# Altium project uC_Interface_PCB.PrjPcb
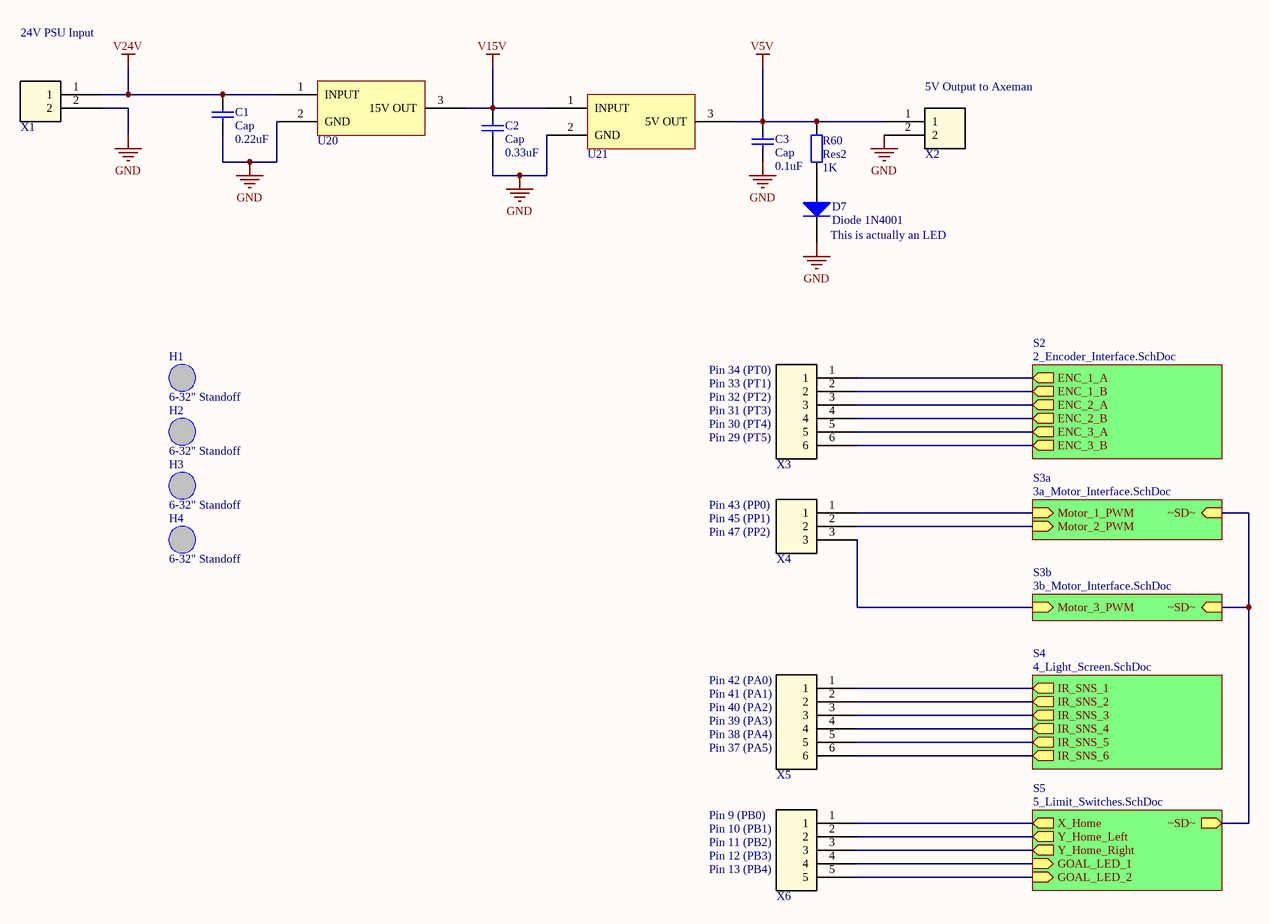
[diagram p0: 1_Top_Sheet.SchDoc]
6 sheets, 208 parts. Net scope: hierarchical (ports join the sheet entries above them; power ports are global).
Board file: uC_interface_pcb.PcbDoc
Sheets:
  1_Top_Sheet.SchDoc
    S2 = 2_Encoder_Interface.SchDoc
    S3a = 3a_Motor_Interface.SchDoc
    S3b = 3b_Motor_Interface.SchDoc
    S4 = 4_Light_Screen.SchDoc
    S5 = 5_Limit_Switches.SchDoc

## Sheet 1_Top_Sheet.SchDoc
size B

### Parts
C1  Cap  value 0.22uF  [RAD-0.3]
C2  Cap  value 0.33uF  [RAD-0.3]
C3  Cap  value 0.1uF  [RAD-0.3]
D7  Diode 1N4001  [DO-41]
H1  6-32" Standoff  [6-32" Standoff]
H2  6-32" Standoff  [6-32" Standoff]
H3  6-32" Standoff  [6-32" Standoff]
H4  6-32" Standoff  [6-32" Standoff]
R60  Res2  value 1K  [AXIAL-0.4]
U20  IC REG LINEAR 15V 1A TO220-3  [TO-220]  (value not drawn)
U21  IC REG LINEAR 5V 1.5A TO220-3  [TO-220]  (value not drawn)
X1  TERM BLOCK HDR 2POS VERT 7.62MM  [PCV 4-2]  (value not drawn)
X2  TERM BLOCK HDR 2POS VERT 3.5MM  [WR-TBL-3211 2]  (value not drawn)
X3  TERM BLOCK HDR 6POS VERT 3.5MM  [WR-TBL-3211 6]  (value not drawn)
X4  TERM BLOCK HDR 3POS VERT 3.5MM  [WR-TBL-3211 3]  (value not drawn)
X5  TERM BLOCK HDR 6POS VERT 3.5MM  [WR-TBL-3211 6]  (value not drawn)
X6  TERM BLOCK HDR 5POS VERT 3.5MM  [WR-TBL-3211 5]  (value not drawn)

### Sub-sheets
S2 = 2_Encoder_Interface.SchDoc: ENC_1_A (out), ENC_1_B (out), ENC_2_A (out), ENC_2_B (out), ENC_3_A (out), ENC_3_B (out)
S3a = 3a_Motor_Interface.SchDoc: Motor_1_PWM (in), Motor_2_PWM (in), ~SD~ (in)
S3b = 3b_Motor_Interface.SchDoc: Motor_3_PWM (in), ~SD~ (in)
S4 = 4_Light_Screen.SchDoc: IR_SNS_1 (out), IR_SNS_2 (out), IR_SNS_3 (out), IR_SNS_4 (out), IR_SNS_5 (out), IR_SNS_6 (out)
S5 = 5_Limit_Switches.SchDoc: X_Home (out), Y_Home_Left (out), Y_Home_Right (out), ~SD~ (out), GOAL_LED_1 (in), GOAL_LED_2 (in)

### Nets
GND: C1.1 C2.1 C3.1 D7.2(K) U20.2(GND) U21.2(GND) X1.2 X2.2
V5V: C3.2 R60.2 U21.3(5V_OUT) X2.1
V15V: C2.2 U20.3(15V_OUT) U21.1(INPUT)
V24V: C1.2 U20.1(INPUT) X1.1
ENC_1_A: X3.1 ; sheet S2/ENC_1_A
ENC_1_B: X3.2 ; sheet S2/ENC_1_B
ENC_2_A: X3.3 ; sheet S2/ENC_2_A
ENC_2_B: X3.4 ; sheet S2/ENC_2_B
ENC_3_A: X3.5 ; sheet S2/ENC_3_A
ENC_3_B: X3.6 ; sheet S2/ENC_3_B
GOAL_LED_1: X6.4 ; sheet S5/GOAL_LED_1
GOAL_LED_2: X6.5 ; sheet S5/GOAL_LED_2
IR_SNS_1: X5.1 ; sheet S4/IR_SNS_1
IR_SNS_2: X5.2 ; sheet S4/IR_SNS_2
IR_SNS_3: X5.3 ; sheet S4/IR_SNS_3
IR_SNS_4: X5.4 ; sheet S4/IR_SNS_4
IR_SNS_5: X5.5 ; sheet S4/IR_SNS_5
IR_SNS_6: X5.6 ; sheet S4/IR_SNS_6
Motor_1_PWM: X4.1 ; sheet S3a/Motor_1_PWM
Motor_2_PWM: X4.2 ; sheet S3a/Motor_2_PWM
Motor_3_PWM: X4.3 ; sheet S3b/Motor_3_PWM
X_Home: X6.1 ; sheet S5/X_Home
Y_Home_Left: X6.2 ; sheet S5/Y_Home_Left
Y_Home_Right: X6.3 ; sheet S5/Y_Home_Right
~SD~: sheet S3a/~SD~, sheet S3b/~SD~, sheet S5/~SD~
NetD7_1: D7.1(A) R60.1

### Notes on the sheet
- 24V PSU Input
- (near X2) 5V Output to Axeman
- (near D7) This is actually an LED
- (near X3) Pin 34 (PT0)
- (near X3) Pin 33 (PT1)
- (near X3) Pin 32 (PT2)
- (near X3) Pin 31 (PT3)
- (near X3) Pin 30 (PT4)
- (near X3) Pin 29 (PT5)
- (near X4) Pin 43 (PP0)
- (near X4) Pin 45 (PP1)
- (near X4) Pin 47 (PP2)
- (near X5) Pin 42 (PA0)
- (near X5) Pin 41 (PA1)
- (near X5) Pin 40 (PA2)
- (near X5) Pin 39 (PA3)
- (near X5) Pin 38 (PA4)
- (near X5) Pin 37 (PA5)
- (near X6) Pin 9 (PB0)
- (near X6) Pin 10 (PB1)
- (near X6) Pin 11 (PB2)
- (near X6) Pin 12 (PB3)
- (near X6) Pin 13 (PB4)
- ESE
- is the sole property of ESE. Any reproduction
- The Information Contained in this drawing
- Schematic P/N and Name
- Sheet Name
- 299 Doon Valley Drive
- Kitchener, ON N2G 4M4
- Canada
- Approved
- in part or in whole without the written
- permission of ESE is strictly prohibited.
- APPROVALS
- DATE
- Size
- Scale
- B
- NTS
- Bare PCB P/N
- Date
- Sheet
- Rev.
- Checked
- Engineer
- of

### Library data of the parts
C1-C3 = Cap: Capacitor; Published: 8-Jun-2000; LatestRevisionDate: 17-Jul-2002; LatestRevisionNote: Re-released for DXP Platform.; PackageReference: RAD-0.3; Publisher: Altium Limited; PackageDescription: Radial Cap, Thru-Hole; 2 Leads; 0.3 in Pin Spacing
D7 = Diode 1N4001: 1 Amp General Purpose Rectifier; Published: 8-Jun-2000; LatestRevisionDate: 17-Jul-2002; LatestRevisionNote: Re-released for DXP Platform.; DatasheetVersion: 1998; PackageVersion: Aug-1999; PackageReference: DO-41; Publisher: Altium Limited; PackageDescription: Diode, Axial; Body 5.2 x 2.7 mm (LxDia. max), Lead Dia. 0.86 mm (max); Code_JEDEC: DO-204-AL; ComponentLink1Description: Manufacturer Link; ComponentLink1URL: http://www.fairchildsemi.com/; ComponentLink2Description: Datasheet; ComponentLink2URL: http://www.fairchildsemi.com/ds/1N%2F1N4001.pdf
H1-H4 = 6-32" Standoff: Mounting hole for 6-32" Standoff
R60 = Res2: Resistor; Published: 8-Jun-2000; LatestRevisionDate: 17-Jul-2002; LatestRevisionNote: Re-released for DXP Platform.; PackageReference: AXIAL-0.4; Publisher: Altium Limited; PackageDescription: Axial Device, Thru-Hole; 2 Leads; 0.4 in Pin Spacing
U20 = IC REG LINEAR 15V 1A TO220-3: Manufacturer_Part_Number: LM340T-15/NOPB; Manufacturer: Texas Instruments; Digi-Key_Part_Number: LM340T-15/NOPB-ND
U21 = IC REG LINEAR 5V 1.5A TO220-3: Manufacturer_Part_Number: UA7805CKCS; Manufacturer: Texas Instruments; Digi-Key_Part_Number: 296-13996-5-ND
X1 = TERM BLOCK HDR 2POS VERT 7.62MM: Manufacturer_Part_Number: 1804687; Manufacturer: Phoenix Contact; DigiKey_Part_Number: 277-1469-ND
X2 = TERM BLOCK HDR 2POS VERT 3.5MM: Manufacturer_Part_Number: 691321100002; Manufacturer: Wurth Electronics Inc; DigiKey_Part_Number: 732-2763-ND
X3 X5 = TERM BLOCK HDR 6POS VERT 3.5MM: Manufacturer_Part_Number: 691321100006; Manufacturer: Wurth Electronics Inc; DigiKey_Part_Number: 732-2767-ND
X4 = TERM BLOCK HDR 3POS VERT 3.5MM: Manufacturer_Part_Number: 691321100003; Manufacturer: Wurth Electronics Inc; DigiKey_Part_Number: 732-2764-ND
X6 = TERM BLOCK HDR 5POS VERT 3.5MM: Manufacturer_Part_Number: 691321100005; Manufacturer: Wurth Electronics Inc; DigiKey_Part_Number: 732-2766-ND

## Sheet 2_Encoder_Interface.SchDoc
size B
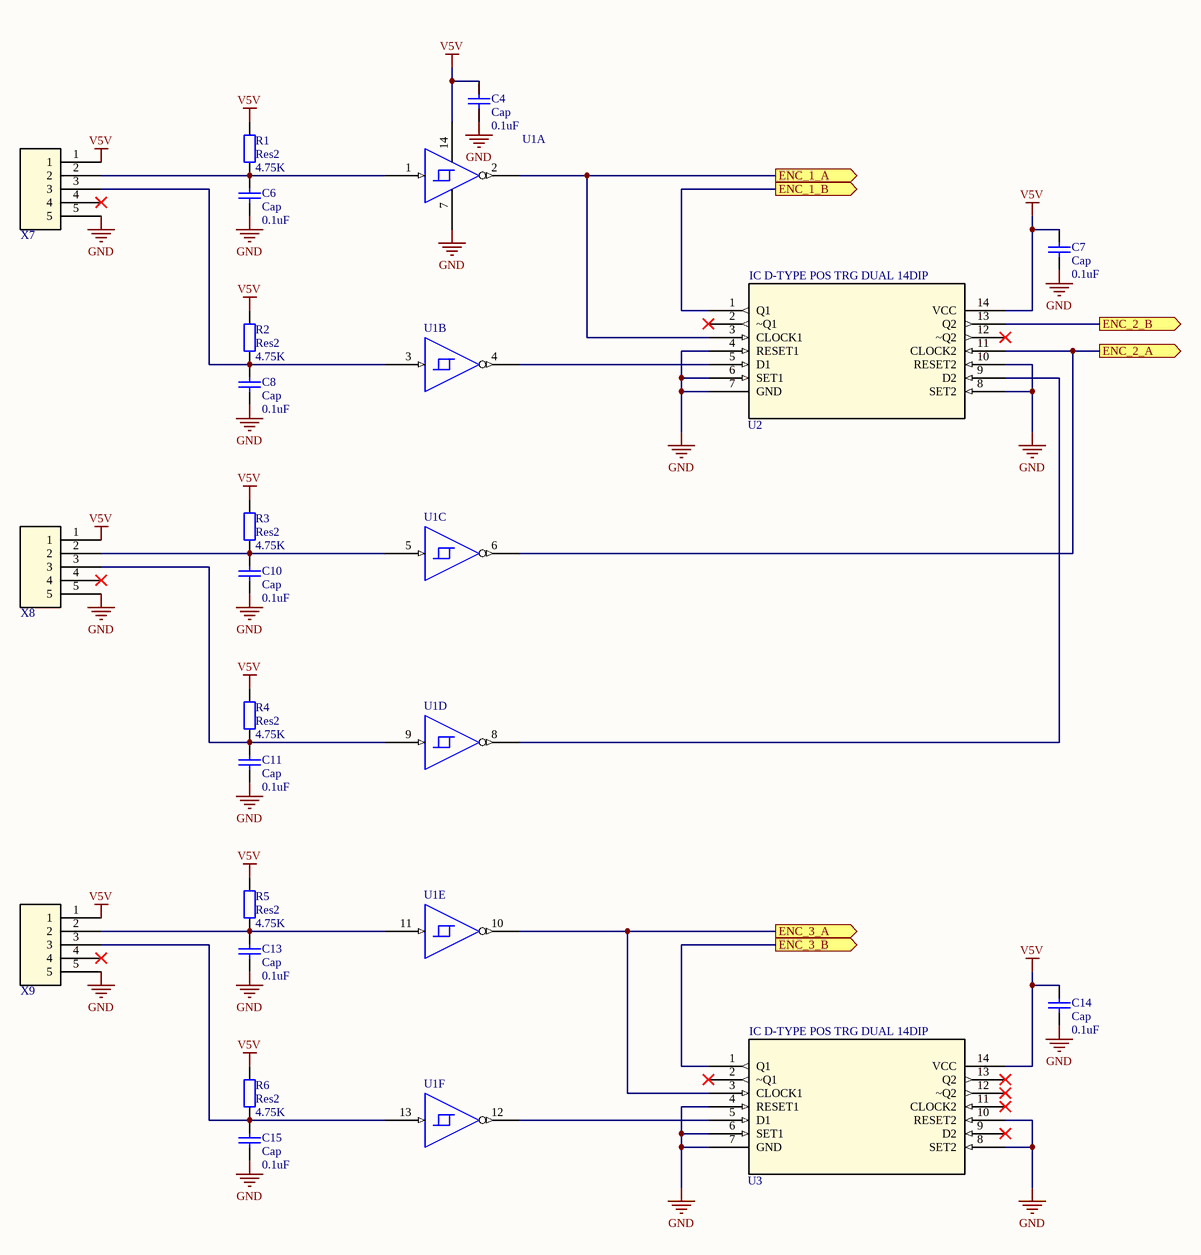
[diagram p1: 2_Encoder_Interface.SchDoc]

### Parts
C4  Cap  value 0.1uF  [RAD-0.3]
C6  Cap  value 0.1uF  [RAD-0.3]
C7  Cap  value 0.1uF  [RAD-0.3]
C8  Cap  value 0.1uF  [RAD-0.3]
C10  Cap  value 0.1uF  [RAD-0.3]
C11  Cap  value 0.1uF  [RAD-0.3]
C13  Cap  value 0.1uF  [RAD-0.3]
C14  Cap  value 0.1uF  [RAD-0.3]
C15  Cap  value 0.1uF  [RAD-0.3]
R1  Res2  value 4.75K  [AXIAL-0.4]
R2  Res2  value 4.75K  [AXIAL-0.4]
R3  Res2  value 4.75K  [AXIAL-0.4]
R4  Res2  value 4.75K  [AXIAL-0.4]
R5  Res2  value 4.75K  [AXIAL-0.4]
R6  Res2  value 4.75K  [AXIAL-0.4]
U1  IC HEX SCHMITT-TRIG INV 14-DIP  [14-DIP]  (value not drawn)  (parts A,B,C,D,E,F of 6)
U2  IC D-TYPE POS TRG DUAL 14DIP  [14-DIP]
U3  IC D-TYPE POS TRG DUAL 14DIP  [14-DIP]
X7  TERM BLOCK HDR 5POS VERT 3.5MM  [WR-TBL-3211 5]  (value not drawn)
X8  TERM BLOCK HDR 5POS VERT 3.5MM  [WR-TBL-3211 5]  (value not drawn)
X9  TERM BLOCK HDR 5POS VERT 3.5MM  [WR-TBL-3211 5]  (value not drawn)

### Ports
ENC_1_A (out), ENC_1_B (out), ENC_2_A (out), ENC_2_B (out), ENC_3_A (out), ENC_3_B (out)

### Nets
GND: C4.1 C6.1 C7.1 C8.1 C10.1 C11.1 C13.1 C14.1 C15.1 U1.7(GND_POWER) U2.4(RESET1) U2.6(SET1) U2.7(GND) U2.8(SET2) U2.10(RESET2) U3.4(RESET1) U3.6(SET1) U3.7(GND) U3.8(SET2) U3.10(RESET2) X7.5 X8.5 X9.5
V5V: C4.2 C7.2 C14.2 R1.2 R2.2 R3.2 R4.2 R5.2 R6.2 U1.14(VCC) U2.14(VCC) U3.14(VCC) X7.1 X8.1 X9.1
ENC_1_A: U1.2(Y) U2.3(CLOCK1) ; port ENC_1_A
ENC_1_B: U2.1(Q1) ; port ENC_1_B
ENC_2_A: U1.6(Y) U2.11(CLOCK2) ; port ENC_2_A
ENC_2_B: U2.13(Q2) ; port ENC_2_B
ENC_3_A: U1.10(Y) U3.3(CLOCK1) ; port ENC_3_A
ENC_3_B: U3.1(Q1) ; port ENC_3_B
NetC6_2: C6.2 R1.1 U1.1(A) X7.2
NetC8_2: C8.2 R2.1 U1.3(A) X7.3
NetC10_2: C10.2 R3.1 U1.5(A) X8.2
NetC11_2: C11.2 R4.1 U1.9(A) X8.3
NetC13_2: C13.2 R5.1 U1.11(A) X9.2
NetC15_2: C15.2 R6.1 U1.13(A) X9.3
NetU1_4: U1.4(Y) U2.5(D1)
NetU1_8: U1.8(Y) U2.9(D2)
NetU1_12: U1.12(Y) U3.5(D1)

Not connected (* = marked no-connect by the designer): U2 2(~Q1)* 12(~Q2)*; U3 2(~Q1)* 9(D2)* 11(CLOCK2)* 12(~Q2)* 13(Q2)*; X7 4*; X8 4*; X9 4*

### Notes on the sheet
- ESE
- is the sole property of ESE. Any reproduction
- The Information Contained in this drawing
- Schematic P/N and Name
- Sheet Name
- 299 Doon Valley Drive
- Kitchener, ON N2G 4M4
- Canada
- Approved
- in part or in whole without the written
- permission of ESE is strictly prohibited.
- APPROVALS
- DATE
- Size
- Scale
- B
- NTS
- Bare PCB P/N
- Date
- Sheet
- Rev.
- Checked
- Engineer
- of

### Library data of the parts
C4 C6-C8 C10 C11 C13-C15 = Cap: Capacitor; Published: 8-Jun-2000; LatestRevisionDate: 17-Jul-2002; LatestRevisionNote: Re-released for DXP Platform.; PackageReference: RAD-0.3; Publisher: Altium Limited; PackageDescription: Radial Cap, Thru-Hole; 2 Leads; 0.3 in Pin Spacing
R1-R6 = Res2: Resistor; Published: 8-Jun-2000; LatestRevisionDate: 17-Jul-2002; LatestRevisionNote: Re-released for DXP Platform.; PackageReference: AXIAL-0.4; Publisher: Altium Limited; PackageDescription: Axial Device, Thru-Hole; 2 Leads; 0.4 in Pin Spacing
U1 = IC HEX SCHMITT-TRIG INV 14-DIP: Manufactuer_Part_Number: SN74ACT14N; Manufacturer: Texas Instruments; Digi-Key_Part_Number: 296-4368-5-ND
U2 U3 = IC D-TYPE POS TRG DUAL 14DIP: Manufacturer_Part_Number: CD4013BE; Manufacturer: Texas Instruments; Digi-Key_Part_Number: 296-2033-5-ND
X7-X9 = TERM BLOCK HDR 5POS VERT 3.5MM: as X6 on sheet 1_Top_Sheet; DigiKey_Part_Number: 732-2766-ND

## Sheet 3a_Motor_Interface.SchDoc
size B
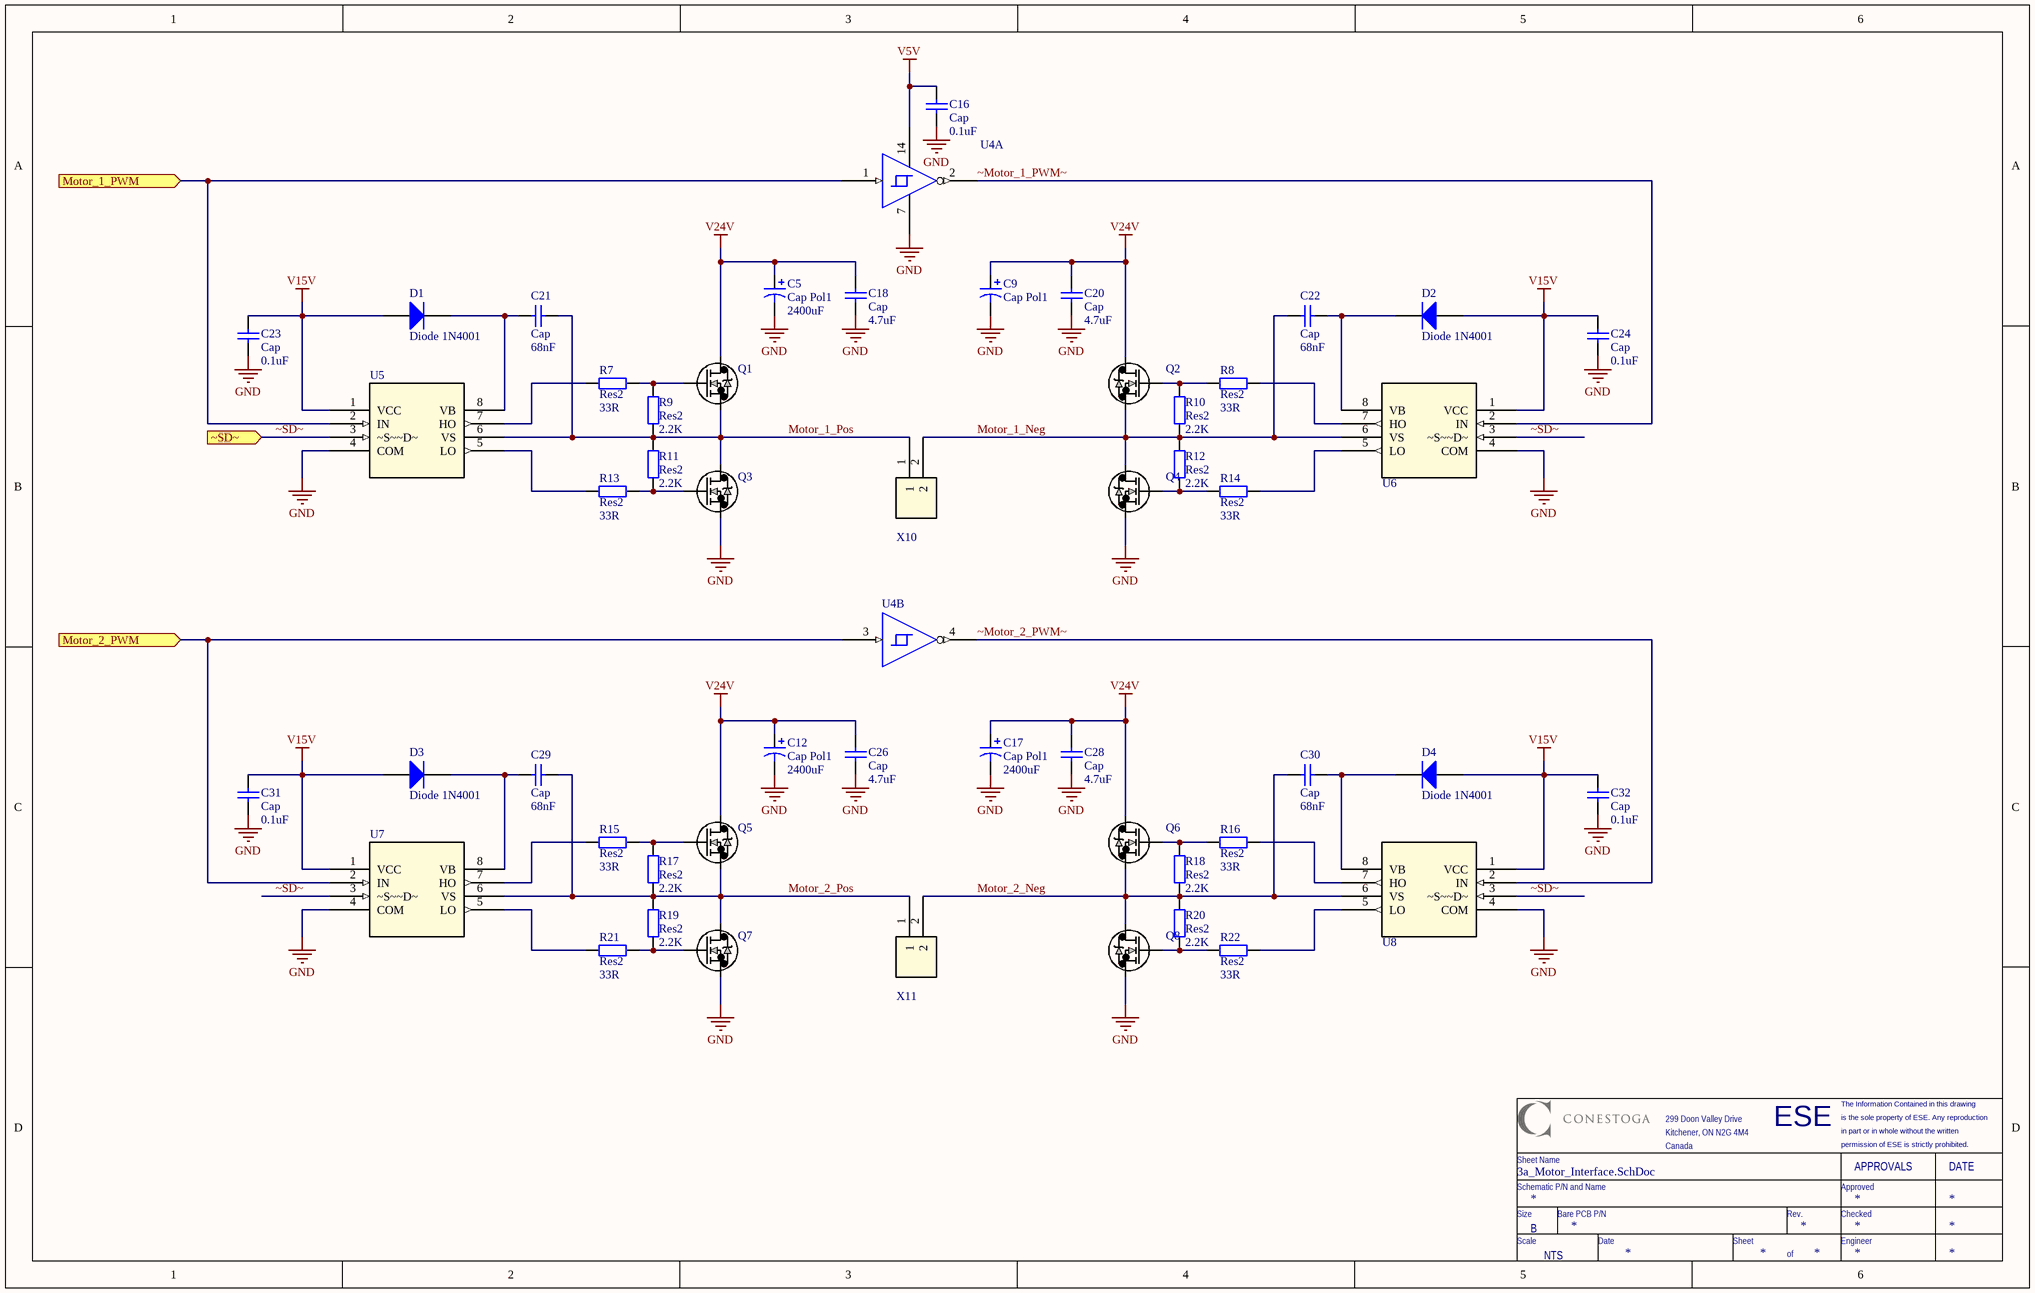
[diagram p2: 3a_Motor_Interface.SchDoc]

### Parts
C5  Cap Pol1  value 2400uF  [RB7.6-15]
C9  Cap Pol1  [RB7.6-15]
C12  Cap Pol1  value 2400uF  [RB7.6-15]
C16  Cap  value 0.1uF  [RAD-0.3]
C17  Cap Pol1  value 2400uF  [RB7.6-15]
C18  Cap  value 4.7uF  [RAD-0.3]
C20  Cap  value 4.7uF  [RAD-0.3]
C21  Cap  value 68nF  [RAD-0.3]
C22  Cap  value 68nF  [RAD-0.3]
C23  Cap  value 0.1uF  [RAD-0.3]
C24  Cap  value 0.1uF  [RAD-0.3]
C26  Cap  value 4.7uF  [RAD-0.3]
C28  Cap  value 4.7uF  [RAD-0.3]
C29  Cap  value 68nF  [RAD-0.3]
C30  Cap  value 68nF  [RAD-0.3]
C31  Cap  value 0.1uF  [RAD-0.3]
C32  Cap  value 0.1uF  [RAD-0.3]
D1  Diode 1N4001  [DO-41]
D2  Diode 1N4001  [DO-41]
D3  Diode 1N4001  [DO-41]
D4  Diode 1N4001  [DO-41]
Q1  STP100N6F7  [TO-220]  (value not drawn)
Q2  STP100N6F7  [TO-220]  (value not drawn)
Q3  STP100N6F7  [TO-220]  (value not drawn)
Q4  STP100N6F7  [TO-220]  (value not drawn)
Q5  STP100N6F7  [TO-220]  (value not drawn)
Q6  STP100N6F7  [TO-220]  (value not drawn)
Q7  STP100N6F7  [TO-220]  (value not drawn)
Q8  STP100N6F7  [TO-220]  (value not drawn)
R7  Res2  value 33R  [AXIAL-0.4]
R8  Res2  value 33R  [AXIAL-0.4]
R9  Res2  value 2.2K  [AXIAL-0.4]
R10  Res2  value 2.2K  [AXIAL-0.4]
R11  Res2  value 2.2K  [AXIAL-0.4]
R12  Res2  value 2.2K  [AXIAL-0.4]
R13  Res2  value 33R  [AXIAL-0.4]
R14  Res2  value 33R  [AXIAL-0.4]
R15  Res2  value 33R  [AXIAL-0.4]
R16  Res2  value 33R  [AXIAL-0.4]
R17  Res2  value 2.2K  [AXIAL-0.4]
R18  Res2  value 2.2K  [AXIAL-0.4]
R19  Res2  value 2.2K  [AXIAL-0.4]
R20  Res2  value 2.2K  [AXIAL-0.4]
R21  Res2  value 33R  [AXIAL-0.4]
R22  Res2  value 33R  [AXIAL-0.4]
U4  IC HEX SCHMITT-TRIG INV 14-DIP  [14-DIP]  (value not drawn)  (parts A,B of 6)
U5  IC DRIVER HALF BRIDGE 8DIP  [8-DIP]  (value not drawn)
U6  IC DRIVER HALF BRIDGE 8DIP  [8-DIP]  (value not drawn)
U7  IC DRIVER HALF BRIDGE 8DIP  [8-DIP]  (value not drawn)
U8  IC DRIVER HALF BRIDGE 8DIP  [8-DIP]  (value not drawn)
X10  TERM BLOCK HDR 2POS VERT 3.5MM  [WR-TBL-3211 2]  (value not drawn)
X11  TERM BLOCK HDR 2POS VERT 3.5MM  [WR-TBL-3211 2]  (value not drawn)

### Ports
Motor_1_PWM (in), Motor_2_PWM (in), ~SD~ (in)

### Nets
GND: C5.2 C9.2 C12.2 C16.1 C17.2 C18.1 C20.1 C23.1 C24.1 C26.1 C28.1 C31.1 C32.1 Q3.3 Q4.3 Q7.3 Q8.3 U4.7(GND_POWER) U5.4(COM) U6.4(COM) U7.4(COM) U8.4(COM)
V5V: C16.2 U4.14(VCC)
V15V: C23.2 C24.2 C31.2 C32.2 D1.1(A) D2.1(A) D3.1(A) D4.1(A) U5.1(VCC) U6.1(VCC) U7.1(VCC) U8.1(VCC)
V24V: C5.1 C9.1 C12.1 C17.1 C18.2 C20.2 C26.2 C28.2 Q1.2 Q2.2 Q5.2 Q6.2
Motor_1_Neg: C22.1 Q2.3 Q4.2 R10.2 R12.1 U6.6(VS) X10.2
Motor_1_Pos: C21.1 Q1.3 Q3.2 R9.2 R11.1 U5.6(VS) X10.1
Motor_1_PWM: U4.1(A) U5.2(IN) ; port Motor_1_PWM
Motor_2_Neg: C30.1 Q6.3 Q8.2 R18.2 R20.1 U8.6(VS) X11.2
Motor_2_Pos: C29.1 Q5.3 Q7.2 R17.2 R19.1 U7.6(VS) X11.1
Motor_2_PWM: U4.3(A) U7.2(IN) ; port Motor_2_PWM
~Motor_1_PWM~: U4.2(Y) U6.2(IN)
~Motor_2_PWM~: U4.4(Y) U8.2(IN)
~SD~: U5.3(~S~~D~) U6.3(~S~~D~) U7.3(~S~~D~) U8.3(~S~~D~) ; port ~SD~
NetC21_2: C21.2 D1.2(K) U5.8(VB)
NetC22_2: C22.2 D2.2(K) U6.8(VB)
NetC29_2: C29.2 D3.2(K) U7.8(VB)
NetC30_2: C30.2 D4.2(K) U8.8(VB)
NetQ1_1: Q1.1 R7.1 R9.1
NetQ2_1: Q2.1 R8.1 R10.1
NetQ3_1: Q3.1 R11.2 R13.1
NetQ4_1: Q4.1 R12.2 R14.1
NetQ5_1: Q5.1 R15.1 R17.1
NetQ6_1: Q6.1 R16.1 R18.1
NetQ7_1: Q7.1 R19.2 R21.1
NetQ8_1: Q8.1 R20.2 R22.1
NetR7_2: R7.2 U5.7(HO)
NetR8_2: R8.2 U6.7(HO)
NetR13_2: R13.2 U5.5(LO)
NetR14_2: R14.2 U6.5(LO)
NetR15_2: R15.2 U7.7(HO)
NetR16_2: R16.2 U8.7(HO)
NetR21_2: R21.2 U7.5(LO)
NetR22_2: R22.2 U8.5(LO)

### Notes on the sheet
- ESE
- is the sole property of ESE. Any reproduction
- The Information Contained in this drawing
- Schematic P/N and Name
- Sheet Name
- 299 Doon Valley Drive
- Kitchener, ON N2G 4M4
- Canada
- Approved
- in part or in whole without the written
- permission of ESE is strictly prohibited.
- APPROVALS
- DATE
- Size
- Scale
- B
- NTS
- Bare PCB P/N
- Date
- Sheet
- Rev.
- Checked
- Engineer
- of

### Library data of the parts
C5 C9 C12 C17 = Cap Pol1: Polarized Capacitor (Radial); Published: 8-Jun-2000; LatestRevisionDate: 17-Jul-2002; LatestRevisionNote: Re-released for DXP Platform.; PackageReference: RB7.6-15; Publisher: Altium Limited; PackageDescription: Polarized Capacitor (Radial); 2 Leads
C16 C18 C20-C24 C26 C28-C32 = Cap: Capacitor; Published: 8-Jun-2000; LatestRevisionDate: 17-Jul-2002; LatestRevisionNote: Re-released for DXP Platform.; PackageReference: RAD-0.3; Publisher: Altium Limited; PackageDescription: Radial Cap, Thru-Hole; 2 Leads; 0.3 in Pin Spacing
D1-D4 = Diode 1N4001: 1 Amp General Purpose Rectifier; Published: 8-Jun-2000; LatestRevisionDate: 17-Jul-2002; LatestRevisionNote: Re-released for DXP Platform.; DatasheetVersion: 1998; PackageVersion: Aug-1999; PackageReference: DO-41; Publisher: Altium Limited; PackageDescription: Diode, Axial; Body 5.2 x 2.7 mm (LxDia. max), Lead Dia. 0.86 mm (max); Code_JEDEC: DO-204-AL; ComponentLink1Description: Manufacturer Link; ComponentLink1URL: http://www.fairchildsemi.com/; ComponentLink2Description: Datasheet; ComponentLink2URL: http://www.fairchildsemi.com/ds/1N%2F1N4001.pdf
Q1-Q8 = STP100N6F7: Vendor: STMicroelectronics; Manufacturer_Part_Number: STP100N6F7; Digi-Key_Part_Number: 497-15888-5-ND
R7-R22 = Res2: Resistor; Published: 8-Jun-2000; LatestRevisionDate: 17-Jul-2002; LatestRevisionNote: Re-released for DXP Platform.; PackageReference: AXIAL-0.4; Publisher: Altium Limited; PackageDescription: Axial Device, Thru-Hole; 2 Leads; 0.4 in Pin Spacing
U4 = IC HEX SCHMITT-TRIG INV 14-DIP: as U1 on sheet 2_Encoder_Interface; Digi-Key_Part_Number: 296-4368-5-ND
U5-U8 = IC DRIVER HALF BRIDGE 8DIP: Manufacturer_Part_Number: IR2109PBF; Manufacturer: Infineon Technologies; Digi-Key_Part_Number: IR2109PBF-ND
X10 X11 = TERM BLOCK HDR 2POS VERT 3.5MM: as X2 on sheet 1_Top_Sheet; DigiKey_Part_Number: 732-2763-ND

## Sheet 3b_Motor_Interface.SchDoc
size B
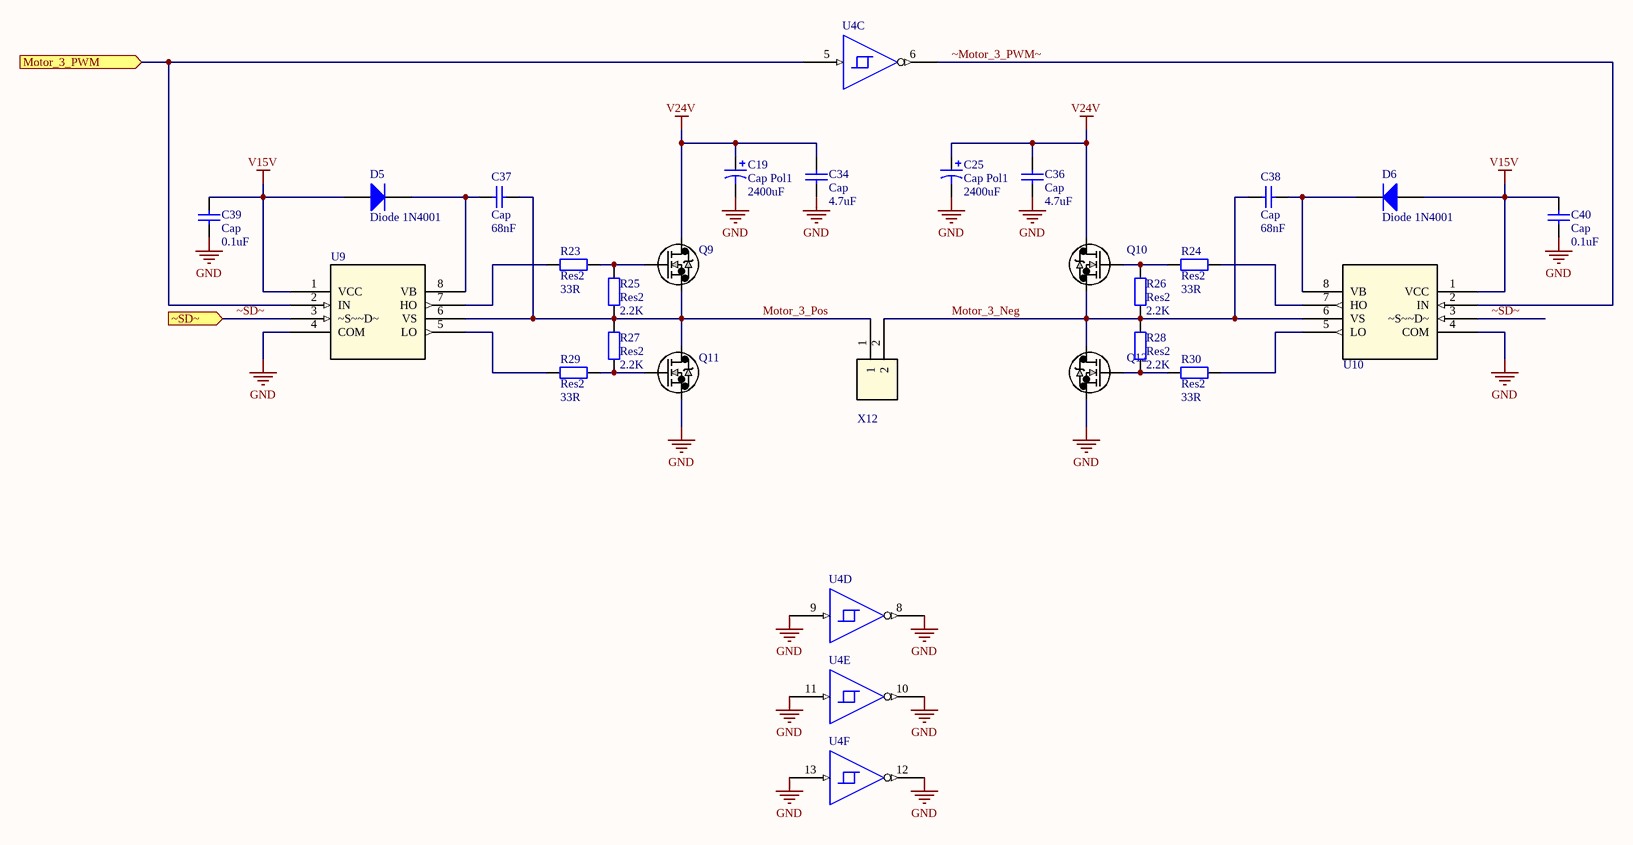
[diagram p3: 3b_Motor_Interface.SchDoc]

### Parts
C19  Cap Pol1  value 2400uF  [RB7.6-15]
C25  Cap Pol1  value 2400uF  [RB7.6-15]
C34  Cap  value 4.7uF  [RAD-0.3]
C36  Cap  value 4.7uF  [RAD-0.3]
C37  Cap  value 68nF  [RAD-0.3]
C38  Cap  value 68nF  [RAD-0.3]
C39  Cap  value 0.1uF  [RAD-0.3]
C40  Cap  value 0.1uF  [RAD-0.3]
D5  Diode 1N4001  [DO-41]
D6  Diode 1N4001  [DO-41]
Q9  STP100N6F7  [TO-220]  (value not drawn)
Q10  STP100N6F7  [TO-220]  (value not drawn)
Q11  STP100N6F7  [TO-220]  (value not drawn)
Q12  STP100N6F7  [TO-220]  (value not drawn)
R23  Res2  value 33R  [AXIAL-0.4]
R24  Res2  value 33R  [AXIAL-0.4]
R25  Res2  value 2.2K  [AXIAL-0.4]
R26  Res2  value 2.2K  [AXIAL-0.4]
R27  Res2  value 2.2K  [AXIAL-0.4]
R28  Res2  value 2.2K  [AXIAL-0.4]
R29  Res2  value 33R  [AXIAL-0.4]
R30  Res2  value 33R  [AXIAL-0.4]
U4  IC HEX SCHMITT-TRIG INV 14-DIP  [14-DIP]  (value not drawn)  (parts C,D,E,F of 6)
U9  IC DRIVER HALF BRIDGE 8DIP  [8-DIP]  (value not drawn)
U10  IC DRIVER HALF BRIDGE 8DIP  [8-DIP]  (value not drawn)
X12  TERM BLOCK HDR 2POS VERT 3.5MM  [WR-TBL-3211 2]  (value not drawn)

### Ports
Motor_3_PWM (in), ~SD~ (in)

### Nets
GND: C19.2 C25.2 C34.1 C36.1 C39.1 C40.1 Q11.3 Q12.3 U4.8(Y) U4.9(A) U4.10(Y) U4.11(A) U4.12(Y) U4.13(A) U9.4(COM) U10.4(COM)
V15V: C39.2 C40.2 D5.1(A) D6.1(A) U9.1(VCC) U10.1(VCC)
V24V: C19.1 C25.1 C34.2 C36.2 Q9.2 Q10.2
Motor_3_Neg: C38.1 Q10.3 Q12.2 R26.2 R28.1 U10.6(VS) X12.2
Motor_3_Pos: C37.1 Q9.3 Q11.2 R25.2 R27.1 U9.6(VS) X12.1
Motor_3_PWM: U4.5(A) U9.2(IN) ; port Motor_3_PWM
~Motor_3_PWM~: U4.6(Y) U10.2(IN)
~SD~: U9.3(~S~~D~) U10.3(~S~~D~) ; port ~SD~
NetC37_2: C37.2 D5.2(K) U9.8(VB)
NetC38_2: C38.2 D6.2(K) U10.8(VB)
NetQ9_1: Q9.1 R23.1 R25.1
NetQ10_1: Q10.1 R24.1 R26.1
NetQ11_1: Q11.1 R27.2 R29.1
NetQ12_1: Q12.1 R28.2 R30.1
NetR23_2: R23.2 U9.7(HO)
NetR24_2: R24.2 U10.7(HO)
NetR29_2: R29.2 U9.5(LO)
NetR30_2: R30.2 U10.5(LO)

### Notes on the sheet
- ESE
- is the sole property of ESE. Any reproduction
- The Information Contained in this drawing
- Schematic P/N and Name
- Sheet Name
- 299 Doon Valley Drive
- Kitchener, ON N2G 4M4
- Canada
- Approved
- in part or in whole without the written
- permission of ESE is strictly prohibited.
- APPROVALS
- DATE
- Size
- Scale
- B
- NTS
- Bare PCB P/N
- Date
- Sheet
- Rev.
- Checked
- Engineer
- of

### Library data of the parts
C19 C25 = Cap Pol1: Polarized Capacitor (Radial); Published: 8-Jun-2000; LatestRevisionDate: 17-Jul-2002; LatestRevisionNote: Re-released for DXP Platform.; PackageReference: RB7.6-15; Publisher: Altium Limited; PackageDescription: Polarized Capacitor (Radial); 2 Leads
C34 C36-C40 = Cap: Capacitor; Published: 8-Jun-2000; LatestRevisionDate: 17-Jul-2002; LatestRevisionNote: Re-released for DXP Platform.; PackageReference: RAD-0.3; Publisher: Altium Limited; PackageDescription: Radial Cap, Thru-Hole; 2 Leads; 0.3 in Pin Spacing
D5 D6 = Diode 1N4001: 1 Amp General Purpose Rectifier; Published: 8-Jun-2000; LatestRevisionDate: 17-Jul-2002; LatestRevisionNote: Re-released for DXP Platform.; DatasheetVersion: 1998; PackageVersion: Aug-1999; PackageReference: DO-41; Publisher: Altium Limited; PackageDescription: Diode, Axial; Body 5.2 x 2.7 mm (LxDia. max), Lead Dia. 0.86 mm (max); Code_JEDEC: DO-204-AL; ComponentLink1Description: Manufacturer Link; ComponentLink1URL: http://www.fairchildsemi.com/; ComponentLink2Description: Datasheet; ComponentLink2URL: http://www.fairchildsemi.com/ds/1N%2F1N4001.pdf
Q9-Q12 = STP100N6F7: Vendor: STMicroelectronics; Manufacturer_Part_Number: STP100N6F7; Digi-Key_Part_Number: 497-15888-5-ND
R23-R30 = Res2: Resistor; Published: 8-Jun-2000; LatestRevisionDate: 17-Jul-2002; LatestRevisionNote: Re-released for DXP Platform.; PackageReference: AXIAL-0.4; Publisher: Altium Limited; PackageDescription: Axial Device, Thru-Hole; 2 Leads; 0.4 in Pin Spacing
U4 = IC HEX SCHMITT-TRIG INV 14-DIP: as U1 on sheet 2_Encoder_Interface; Digi-Key_Part_Number: 296-4368-5-ND
U9 U10 = IC DRIVER HALF BRIDGE 8DIP: as U5 on sheet 3a_Motor_Interface; Digi-Key_Part_Number: IR2109PBF-ND
X12 = TERM BLOCK HDR 2POS VERT 3.5MM: as X2 on sheet 1_Top_Sheet; DigiKey_Part_Number: 732-2763-ND

## Sheet 4_Light_Screen.SchDoc
size B
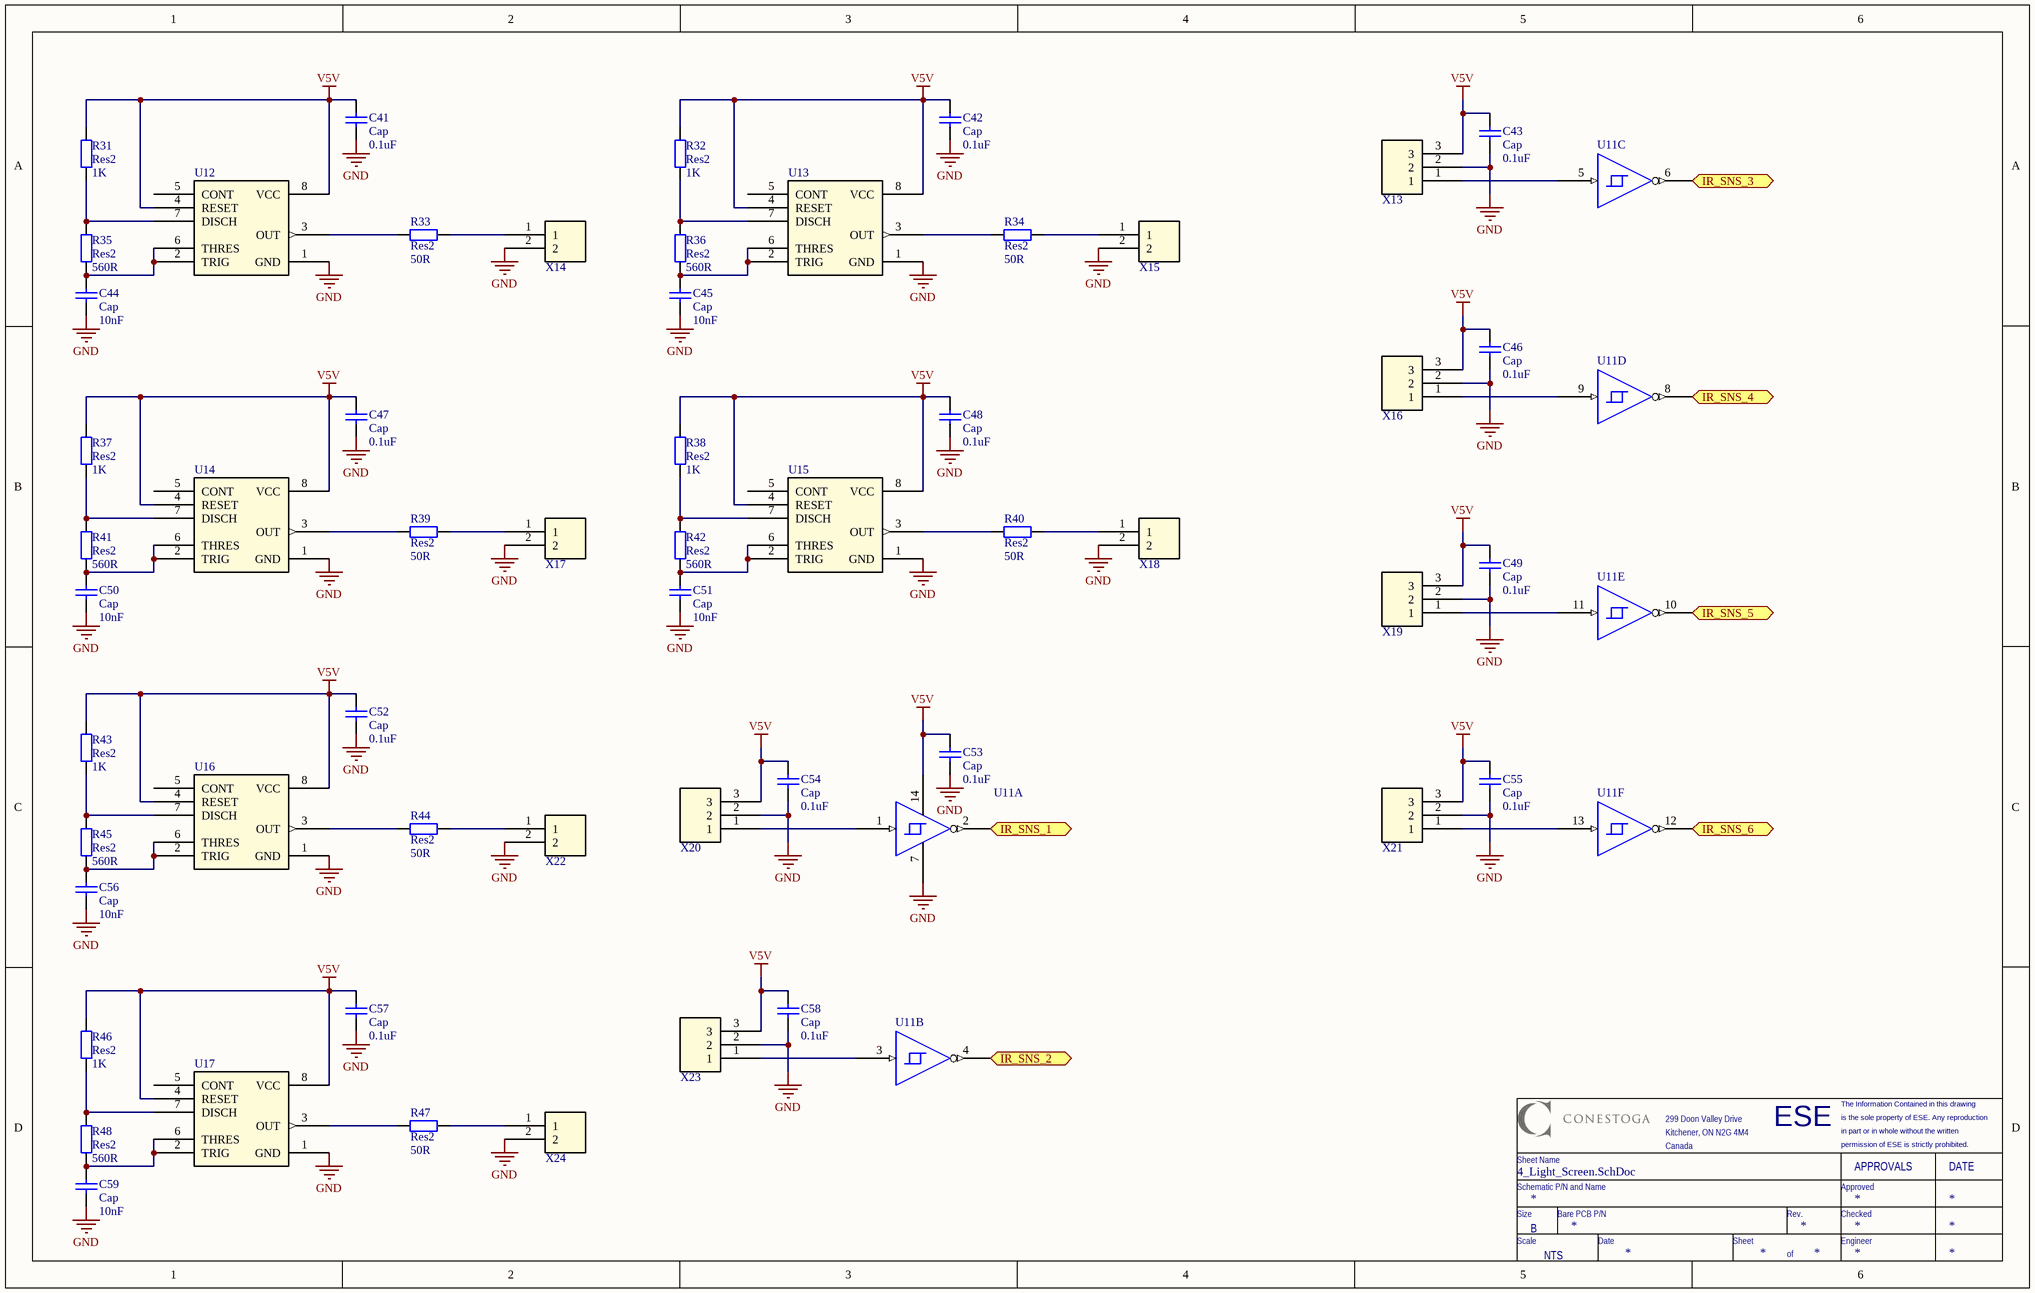
[diagram p4: 4_Light_Screen.SchDoc]

### Parts
C41  Cap  value 0.1uF  [RAD-0.3]
C42  Cap  value 0.1uF  [RAD-0.3]
C43  Cap  value 0.1uF  [RAD-0.3]
C44  Cap  value 10nF  [RAD-0.3]
C45  Cap  value 10nF  [RAD-0.3]
C46  Cap  value 0.1uF  [RAD-0.3]
C47  Cap  value 0.1uF  [RAD-0.3]
C48  Cap  value 0.1uF  [RAD-0.3]
C49  Cap  value 0.1uF  [RAD-0.3]
C50  Cap  value 10nF  [RAD-0.3]
C51  Cap  value 10nF  [RAD-0.3]
C52  Cap  value 0.1uF  [RAD-0.3]
C53  Cap  value 0.1uF  [RAD-0.3]
C54  Cap  value 0.1uF  [RAD-0.3]
C55  Cap  value 0.1uF  [RAD-0.3]
C56  Cap  value 10nF  [RAD-0.3]
C57  Cap  value 0.1uF  [RAD-0.3]
C58  Cap  value 0.1uF  [RAD-0.3]
C59  Cap  value 10nF  [RAD-0.3]
R31  Res2  value 1K  [AXIAL-0.4]
R32  Res2  value 1K  [AXIAL-0.4]
R33  Res2  value 50R  [AXIAL-0.4]
R34  Res2  value 50R  [AXIAL-0.4]
R35  Res2  value 560R  [AXIAL-0.4]
R36  Res2  value 560R  [AXIAL-0.4]
R37  Res2  value 1K  [AXIAL-0.4]
R38  Res2  value 1K  [AXIAL-0.4]
R39  Res2  value 50R  [AXIAL-0.4]
R40  Res2  value 50R  [AXIAL-0.4]
R41  Res2  value 560R  [AXIAL-0.4]
R42  Res2  value 560R  [AXIAL-0.4]
R43  Res2  value 1K  [AXIAL-0.4]
R44  Res2  value 50R  [AXIAL-0.4]
R45  Res2  value 560R  [AXIAL-0.4]
R46  Res2  value 1K  [AXIAL-0.4]
R47  Res2  value 50R  [AXIAL-0.4]
R48  Res2  value 560R  [AXIAL-0.4]
U11  IC HEX SCHMITT-TRIG INV 14-DIP  [14-DIP]  (value not drawn)  (parts A,B,C,D,E,F of 6)
U12  IC OSC SINGLE TIMER 100KHZ 8-DIP  [8-DIP]  (value not drawn)
U13  IC OSC SINGLE TIMER 100KHZ 8-DIP  [8-DIP]  (value not drawn)
U14  IC OSC SINGLE TIMER 100KHZ 8-DIP  [8-DIP]  (value not drawn)
U15  IC OSC SINGLE TIMER 100KHZ 8-DIP  [8-DIP]  (value not drawn)
U16  IC OSC SINGLE TIMER 100KHZ 8-DIP  [8-DIP]  (value not drawn)
U17  IC OSC SINGLE TIMER 100KHZ 8-DIP  [8-DIP]  (value not drawn)
X13  TERM BLOCK HDR 3POS VERT 3.5MM  [WR-TBL-3211 3]  (value not drawn)
X14  TERM BLOCK HDR 2POS VERT 3.5MM  [WR-TBL-3211 2]  (value not drawn)
X15  TERM BLOCK HDR 2POS VERT 3.5MM  [WR-TBL-3211 2]  (value not drawn)
X16  TERM BLOCK HDR 3POS VERT 3.5MM  [WR-TBL-3211 3]  (value not drawn)
X17  TERM BLOCK HDR 2POS VERT 3.5MM  [WR-TBL-3211 2]  (value not drawn)
X18  TERM BLOCK HDR 2POS VERT 3.5MM  [WR-TBL-3211 2]  (value not drawn)
X19  TERM BLOCK HDR 3POS VERT 3.5MM  [WR-TBL-3211 3]  (value not drawn)
X20  TERM BLOCK HDR 3POS VERT 3.5MM  [WR-TBL-3211 3]  (value not drawn)
X21  TERM BLOCK HDR 3POS VERT 3.5MM  [WR-TBL-3211 3]  (value not drawn)
X22  TERM BLOCK HDR 2POS VERT 3.5MM  [WR-TBL-3211 2]  (value not drawn)
X23  TERM BLOCK HDR 3POS VERT 3.5MM  [WR-TBL-3211 3]  (value not drawn)
X24  TERM BLOCK HDR 2POS VERT 3.5MM  [WR-TBL-3211 2]  (value not drawn)

### Ports
IR_SNS_1 (out), IR_SNS_2 (out), IR_SNS_3 (out), IR_SNS_4 (out), IR_SNS_5 (out), IR_SNS_6 (out)

### Nets
GND: C41.1 C42.1 C43.1 C44.1 C45.1 C46.1 C47.1 C48.1 C49.1 C50.1 C51.1 C52.1 C53.1 C54.1 C55.1 C56.1 C57.1 C58.1 C59.1 U11.7(GND_POWER) U12.1(GND) U13.1(GND) U14.1(GND) U15.1(GND) U16.1(GND) U17.1(GND) X13.2 X14.2 X15.2 X16.2 X17.2 X18.2 X19.2 X20.2 X21.2 X22.2 X23.2 X24.2
V5V: C41.2 C42.2 C43.2 C46.2 C47.2 C48.2 C49.2 C52.2 C53.2 C54.2 C55.2 C57.2 C58.2 R31.1 R32.1 R37.1 R38.1 R43.1 R46.1 U11.14(VCC) U12.4(RESET) U12.8(VCC) U13.4(RESET) U13.8(VCC) U14.4(RESET) U14.8(VCC) U15.4(RESET) U15.8(VCC) U16.4(RESET) U16.8(VCC) U17.4(RESET) U17.8(VCC) X13.3 X16.3 X19.3 X20.3 X21.3 X23.3
IR_SNS_1: U11.2(Y) ; port IR_SNS_1
IR_SNS_2: U11.4(Y) ; port IR_SNS_2
IR_SNS_3: U11.6(Y) ; port IR_SNS_3
IR_SNS_4: U11.8(Y) ; port IR_SNS_4
IR_SNS_5: U11.10(Y) ; port IR_SNS_5
IR_SNS_6: U11.12(Y) ; port IR_SNS_6
NetC44_2: C44.2 R35.2 U12.2(TRIG) U12.6(THRES)
NetC45_2: C45.2 R36.2 U13.2(TRIG) U13.6(THRES)
NetC50_2: C50.2 R41.2 U14.2(TRIG) U14.6(THRES)
NetC51_2: C51.2 R42.2 U15.2(TRIG) U15.6(THRES)
NetC56_2: C56.2 R45.2 U16.2(TRIG) U16.6(THRES)
NetC59_2: C59.2 R48.2 U17.2(TRIG) U17.6(THRES)
NetR31_2: R31.2 R35.1 U12.7(DISCH)
NetR32_2: R32.2 R36.1 U13.7(DISCH)
NetR33_1: R33.1 X14.1
NetR33_2: R33.2 U12.3(OUT)
NetR34_1: R34.1 X15.1
NetR34_2: R34.2 U13.3(OUT)
NetR37_2: R37.2 R41.1 U14.7(DISCH)
NetR38_2: R38.2 R42.1 U15.7(DISCH)
NetR39_1: R39.1 X17.1
NetR39_2: R39.2 U14.3(OUT)
NetR40_1: R40.1 X18.1
NetR40_2: R40.2 U15.3(OUT)
NetR43_2: R43.2 R45.1 U16.7(DISCH)
NetR44_1: R44.1 X22.1
NetR44_2: R44.2 U16.3(OUT)
NetR46_2: R46.2 R48.1 U17.7(DISCH)
NetR47_1: R47.1 X24.1
NetR47_2: R47.2 U17.3(OUT)
NetU11_1: U11.1(A) X20.1
NetU11_3: U11.3(A) X23.1
NetU11_5: U11.5(A) X13.1
NetU11_9: U11.9(A) X16.1
NetU11_11: U11.11(A) X19.1
NetU11_13: U11.13(A) X21.1

Not connected (* = marked no-connect by the designer): U12 5(CONT); U13 5(CONT); U14 5(CONT); U15 5(CONT); U16 5(CONT); U17 5(CONT)

### Notes on the sheet
- ESE
- is the sole property of ESE. Any reproduction
- The Information Contained in this drawing
- Schematic P/N and Name
- Sheet Name
- 299 Doon Valley Drive
- Kitchener, ON N2G 4M4
- Canada
- Approved
- in part or in whole without the written
- permission of ESE is strictly prohibited.
- APPROVALS
- DATE
- Size
- Scale
- B
- NTS
- Bare PCB P/N
- Date
- Sheet
- Rev.
- Checked
- Engineer
- of

### Library data of the parts
C41-C59 = Cap: Capacitor; Published: 8-Jun-2000; LatestRevisionDate: 17-Jul-2002; LatestRevisionNote: Re-released for DXP Platform.; PackageReference: RAD-0.3; Publisher: Altium Limited; PackageDescription: Radial Cap, Thru-Hole; 2 Leads; 0.3 in Pin Spacing
R31-R48 = Res2: Resistor; Published: 8-Jun-2000; LatestRevisionDate: 17-Jul-2002; LatestRevisionNote: Re-released for DXP Platform.; PackageReference: AXIAL-0.4; Publisher: Altium Limited; PackageDescription: Axial Device, Thru-Hole; 2 Leads; 0.4 in Pin Spacing
U11 = IC HEX SCHMITT-TRIG INV 14-DIP: as U1 on sheet 2_Encoder_Interface; Digi-Key_Part_Number: 296-4368-5-ND
U12-U17 = IC OSC SINGLE TIMER 100KHZ 8-DIP: Manufacturer_Part_Number: NE555P; Manufacturer: Texas Instruments; Digi-Key_Part_Number: 296-1411-5-ND
X13 X16 X19-X21 X23 = TERM BLOCK HDR 3POS VERT 3.5MM: as X4 on sheet 1_Top_Sheet; DigiKey_Part_Number: 732-2764-ND
X14 X15 X17 X18 X22 X24 = TERM BLOCK HDR 2POS VERT 3.5MM: as X2 on sheet 1_Top_Sheet; DigiKey_Part_Number: 732-2763-ND

## Sheet 5_Limit_Switches.SchDoc
size B
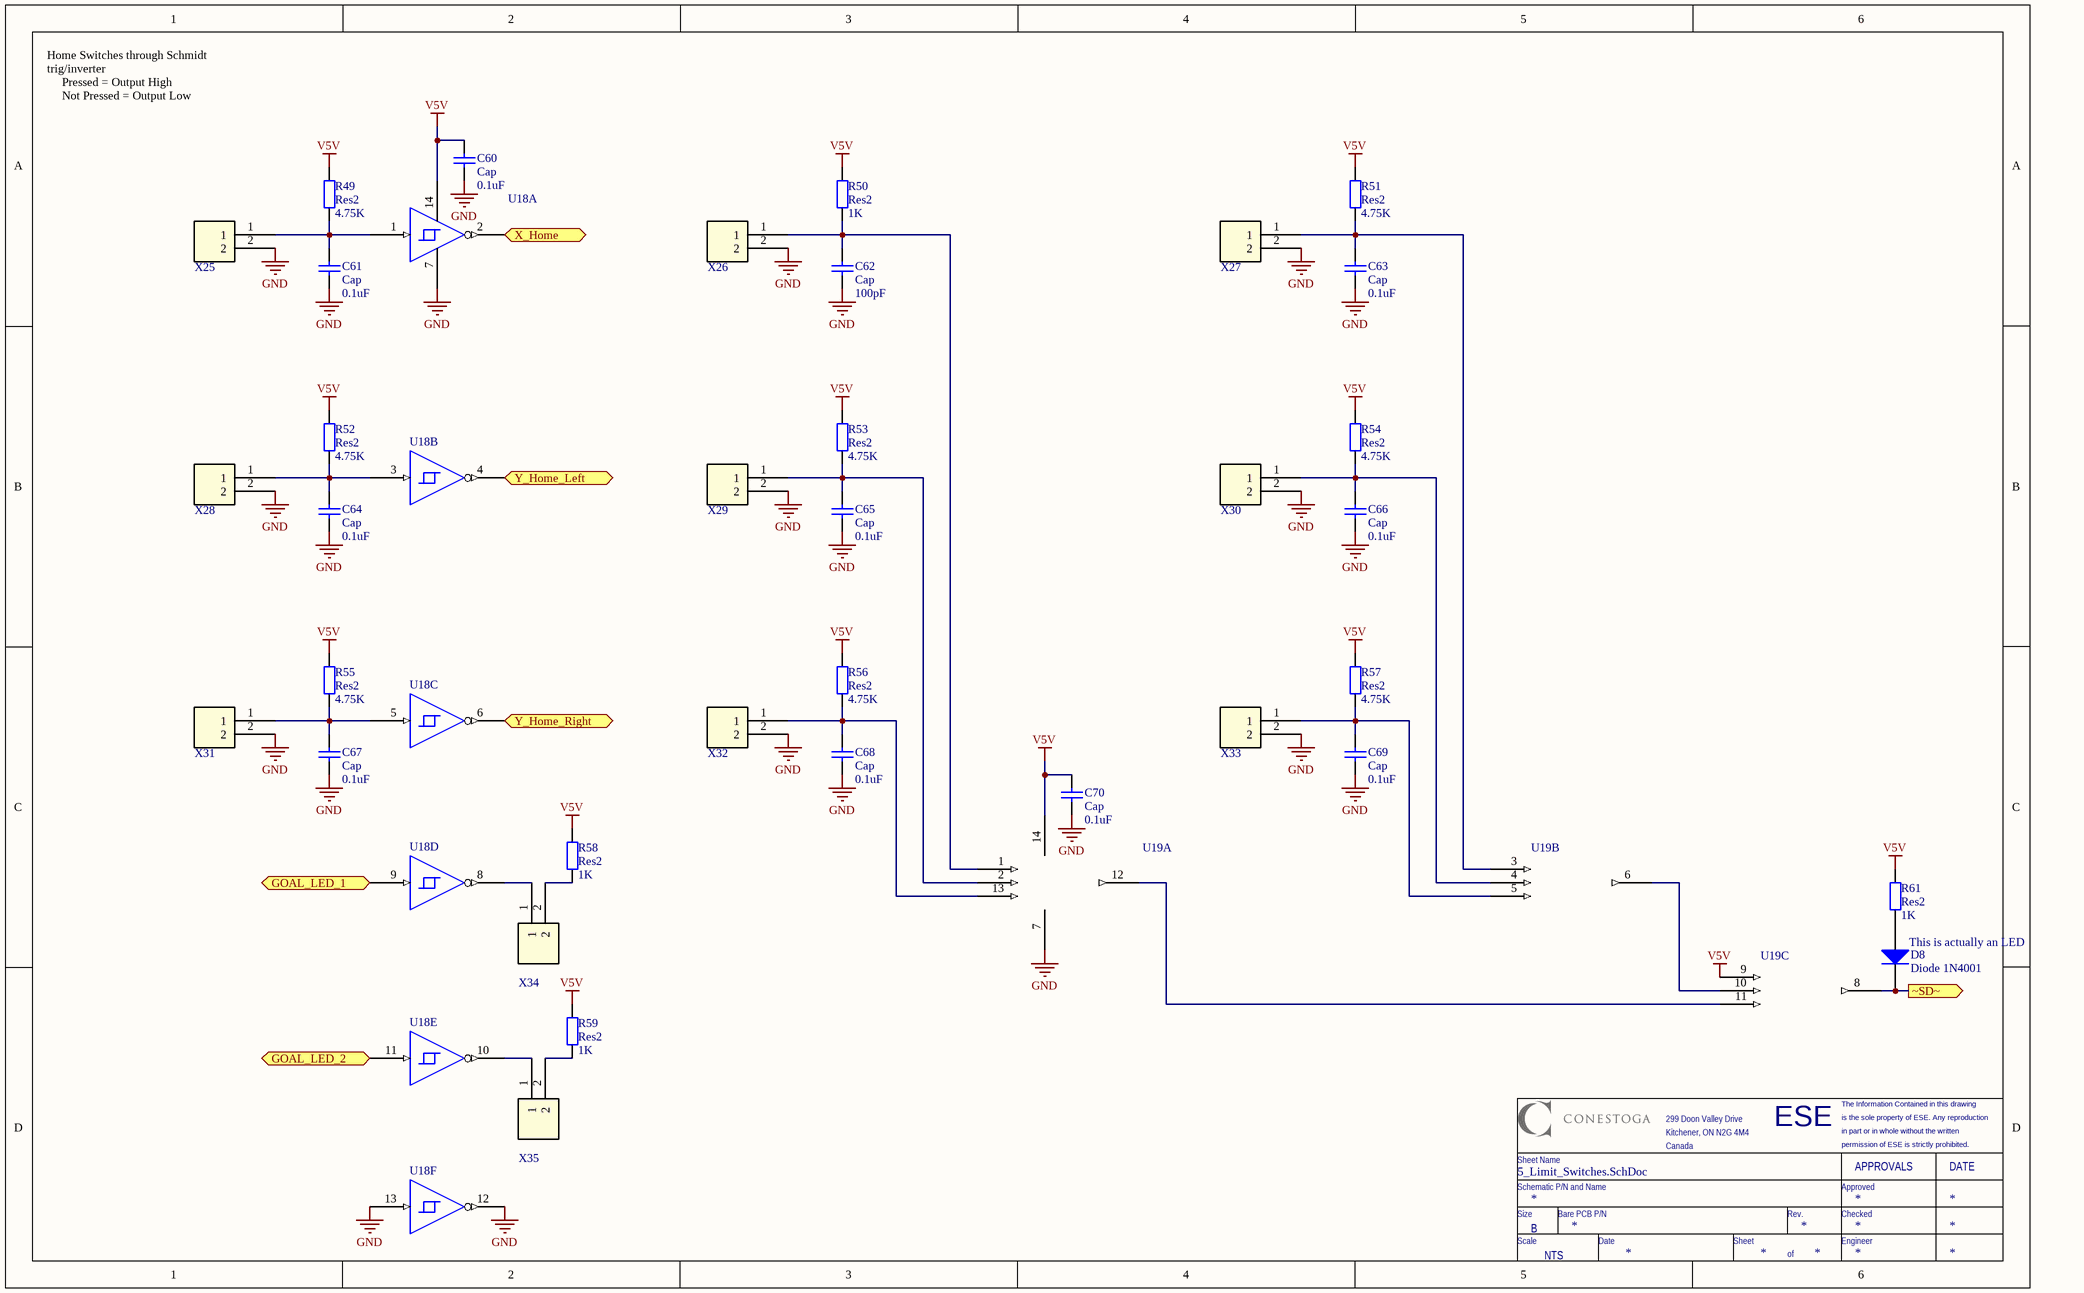
[diagram p5: 5_Limit_Switches.SchDoc]

### Parts
C60  Cap  value 0.1uF  [RAD-0.3]
C61  Cap  value 0.1uF  [RAD-0.3]
C62  Cap  value 100pF  [RAD-0.3]
C63  Cap  value 0.1uF  [RAD-0.3]
C64  Cap  value 0.1uF  [RAD-0.3]
C65  Cap  value 0.1uF  [RAD-0.3]
C66  Cap  value 0.1uF  [RAD-0.3]
C67  Cap  value 0.1uF  [RAD-0.3]
C68  Cap  value 0.1uF  [RAD-0.3]
C69  Cap  value 0.1uF  [RAD-0.3]
C70  Cap  value 0.1uF  [RAD-0.3]
D8  Diode 1N4001  [DO-41]
R49  Res2  value 4.75K  [AXIAL-0.4]
R50  Res2  value 1K  [AXIAL-0.4]
R51  Res2  value 4.75K  [AXIAL-0.4]
R52  Res2  value 4.75K  [AXIAL-0.4]
R53  Res2  value 4.75K  [AXIAL-0.4]
R54  Res2  value 4.75K  [AXIAL-0.4]
R55  Res2  value 4.75K  [AXIAL-0.4]
R56  Res2  value 4.75K  [AXIAL-0.4]
R57  Res2  value 4.75K  [AXIAL-0.4]
R58  Res2  value 1K  [AXIAL-0.4]
R59  Res2  value 1K  [AXIAL-0.4]
R61  Res2  value 1K  [AXIAL-0.4]
U18  IC HEX SCHMITT-TRIG INV 14-DIP  [14-DIP]  (value not drawn)  (parts A,B,C,D,E,F of 6)
U19  IC GATE AND 3CH 3-INP 14DIP  [14-DIP]  (value not drawn)  (parts A,B,C of 3)
X25  TERM BLOCK HDR 2POS VERT 3.5MM  [WR-TBL-3211 2]  (value not drawn)
X26  TERM BLOCK HDR 2POS VERT 3.5MM  [WR-TBL-3211 2]  (value not drawn)
X27  TERM BLOCK HDR 2POS VERT 3.5MM  [WR-TBL-3211 2]  (value not drawn)
X28  TERM BLOCK HDR 2POS VERT 3.5MM  [WR-TBL-3211 2]  (value not drawn)
X29  TERM BLOCK HDR 2POS VERT 3.5MM  [WR-TBL-3211 2]  (value not drawn)
X30  TERM BLOCK HDR 2POS VERT 3.5MM  [WR-TBL-3211 2]  (value not drawn)
X31  TERM BLOCK HDR 2POS VERT 3.5MM  [WR-TBL-3211 2]  (value not drawn)
X32  TERM BLOCK HDR 2POS VERT 3.5MM  [WR-TBL-3211 2]  (value not drawn)
X33  TERM BLOCK HDR 2POS VERT 3.5MM  [WR-TBL-3211 2]  (value not drawn)
X34  TERM BLOCK HDR 2POS VERT 3.5MM  [WR-TBL-3211 2]  (value not drawn)
X35  TERM BLOCK HDR 2POS VERT 3.5MM  [WR-TBL-3211 2]  (value not drawn)

### Ports
GOAL_LED_1 (in), GOAL_LED_2 (in), X_Home (out), Y_Home_Left (out), Y_Home_Right (out), ~SD~ (out)

### Nets
GND: C60.1 C61.1 C62.1 C63.1 C64.1 C65.1 C66.1 C67.1 C68.1 C69.1 C70.1 U18.7(GND_POWER) U18.12(Y) U18.13(A) U19.7(GND_POWER) X25.2 X26.2 X27.2 X28.2 X29.2 X30.2 X31.2 X32.2 X33.2
V5V: C60.2 C70.2 R49.2 R50.2 R51.2 R52.2 R53.2 R54.2 R55.2 R56.2 R57.2 R58.2 R59.2 R61.2 U18.14(VCC) U19.9(3A) U19.14(VCC)
GOAL_LED_1: U18.9(A) ; port GOAL_LED_1
GOAL_LED_2: U18.11(A) ; port GOAL_LED_2
X_Home: U18.2(Y) ; port X_Home
Y_Home_Left: U18.4(Y) ; port Y_Home_Left
Y_Home_Right: U18.6(Y) ; port Y_Home_Right
~SD~: D8.2(K) U19.8(3Y) ; port ~SD~
NetC61_2: C61.2 R49.1 U18.1(A) X25.1
NetC62_2: C62.2 R50.1 U19.1(1A) X26.1
NetC63_2: C63.2 R51.1 U19.3(2A) X27.1
NetC64_2: C64.2 R52.1 U18.3(A) X28.1
NetC65_2: C65.2 R53.1 U19.2(1B) X29.1
NetC66_2: C66.2 R54.1 U19.4(2B) X30.1
NetC67_2: C67.2 R55.1 U18.5(A) X31.1
NetC68_2: C68.2 R56.1 U19.13(1C) X32.1
NetC69_2: C69.2 R57.1 U19.5(2C) X33.1
NetD8_1: D8.1(A) R61.1
NetR58_1: R58.1 X34.2
NetR59_1: R59.1 X35.2
NetU18_8: U18.8(Y) X34.1
NetU18_10: U18.10(Y) X35.1
NetU19_6: U19.6(2Y) U19.10(3B)
NetU19_11: U19.11(3C) U19.12(1Y)

### Notes on the sheet
- Home Switches through Schmidt trig/inverter
  Pressed = Output High
  Not Pressed = Output Low
  Limit Switches through AND gates
  Any switch pressed = Low output
  Low output send to SD pin on half bridge drivers
- (near D8) This is actually an LED
- ESE
- is the sole property of ESE. Any reproduction
- The Information Contained in this drawing
- Schematic P/N and Name
- Sheet Name
- 299 Doon Valley Drive
- Kitchener, ON N2G 4M4
- Canada
- Approved
- in part or in whole without the written
- permission of ESE is strictly prohibited.
- APPROVALS
- DATE
- Size
- Scale
- B
- NTS
- Bare PCB P/N
- Date
- Sheet
- Rev.
- Checked
- Engineer
- of

### Library data of the parts
C60-C70 = Cap: Capacitor; Published: 8-Jun-2000; LatestRevisionDate: 17-Jul-2002; LatestRevisionNote: Re-released for DXP Platform.; PackageReference: RAD-0.3; Publisher: Altium Limited; PackageDescription: Radial Cap, Thru-Hole; 2 Leads; 0.3 in Pin Spacing
D8 = Diode 1N4001: 1 Amp General Purpose Rectifier; Published: 8-Jun-2000; LatestRevisionDate: 17-Jul-2002; LatestRevisionNote: Re-released for DXP Platform.; DatasheetVersion: 1998; PackageVersion: Aug-1999; PackageReference: DO-41; Publisher: Altium Limited; PackageDescription: Diode, Axial; Body 5.2 x 2.7 mm (LxDia. max), Lead Dia. 0.86 mm (max); Code_JEDEC: DO-204-AL; ComponentLink1Description: Manufacturer Link; ComponentLink1URL: http://www.fairchildsemi.com/; ComponentLink2Description: Datasheet; ComponentLink2URL: http://www.fairchildsemi.com/ds/1N%2F1N4001.pdf
R49-R59 R61 = Res2: Resistor; Published: 8-Jun-2000; LatestRevisionDate: 17-Jul-2002; LatestRevisionNote: Re-released for DXP Platform.; PackageReference: AXIAL-0.4; Publisher: Altium Limited; PackageDescription: Axial Device, Thru-Hole; 2 Leads; 0.4 in Pin Spacing
U18 = IC HEX SCHMITT-TRIG INV 14-DIP: as U1 on sheet 2_Encoder_Interface; Digi-Key_Part_Number: 296-4368-5-ND
U19 = IC GATE AND 3CH 3-INP 14DIP: Manufactuer_Part_Number: SN74HC11N; Manufacturer: Texas Instruments; Digi-Key_Part_Number: 296-8217-5-ND
X25-X35 = TERM BLOCK HDR 2POS VERT 3.5MM: as X2 on sheet 1_Top_Sheet; DigiKey_Part_Number: 732-2763-ND

## Nets that join several sheets
GND: 1_Top_Sheet (8 pins), 2_Encoder_Interface (23 pins), 3a_Motor_Interface (22 pins), 3b_Motor_Interface (16 pins), 4_Light_Screen (38 pins), 5_Limit_Switches (24 pins)
V5V: 1_Top_Sheet (C3.2 R60.2 U21.3 X2.1), 2_Encoder_Interface (15 pins), 3a_Motor_Interface (C16.2 U4.14), 4_Light_Screen (38 pins), 5_Limit_Switches (17 pins)
V15V: 1_Top_Sheet (C2.2 U20.3 U21.1), 3a_Motor_Interface (12 pins), 3b_Motor_Interface (6 pins)
V24V: 1_Top_Sheet (C1.2 U20.1 X1.1), 3a_Motor_Interface (12 pins), 3b_Motor_Interface (6 pins)
ENC_1_A: 1_Top_Sheet (X3.1), 2_Encoder_Interface (U1.2 U2.3)
ENC_1_B: 1_Top_Sheet (X3.2), 2_Encoder_Interface (U2.1)
ENC_2_A: 1_Top_Sheet (X3.3), 2_Encoder_Interface (U1.6 U2.11)
ENC_2_B: 1_Top_Sheet (X3.4), 2_Encoder_Interface (U2.13)
ENC_3_A: 1_Top_Sheet (X3.5), 2_Encoder_Interface (U1.10 U3.3)
ENC_3_B: 1_Top_Sheet (X3.6), 2_Encoder_Interface (U3.1)
GOAL_LED_1: 1_Top_Sheet (X6.4), 5_Limit_Switches (U18.9)
GOAL_LED_2: 1_Top_Sheet (X6.5), 5_Limit_Switches (U18.11)
IR_SNS_1: 1_Top_Sheet (X5.1), 4_Light_Screen (U11.2)
IR_SNS_2: 1_Top_Sheet (X5.2), 4_Light_Screen (U11.4)
IR_SNS_3: 1_Top_Sheet (X5.3), 4_Light_Screen (U11.6)
IR_SNS_4: 1_Top_Sheet (X5.4), 4_Light_Screen (U11.8)
IR_SNS_5: 1_Top_Sheet (X5.5), 4_Light_Screen (U11.10)
IR_SNS_6: 1_Top_Sheet (X5.6), 4_Light_Screen (U11.12)
Motor_1_PWM: 1_Top_Sheet (X4.1), 3a_Motor_Interface (U4.1 U5.2)
Motor_2_PWM: 1_Top_Sheet (X4.2), 3a_Motor_Interface (U4.3 U7.2)
Motor_3_PWM: 1_Top_Sheet (X4.3), 3b_Motor_Interface (U4.5 U9.2)
X_Home: 1_Top_Sheet (X6.1), 5_Limit_Switches (U18.2)
Y_Home_Left: 1_Top_Sheet (X6.2), 5_Limit_Switches (U18.4)
Y_Home_Right: 1_Top_Sheet (X6.3), 5_Limit_Switches (U18.6)
~SD~: 3a_Motor_Interface (U5.3 U6.3 U7.3 U8.3), 3b_Motor_Interface (U9.3 U10.3), 5_Limit_Switches (D8.2 U19.8)